# Altium schematic sheet Antenna.SchDoc: Antenna
size A; Author: Micheal Burin; Revision: 1.0; SheetNumber: 3; SheetTotal: 10
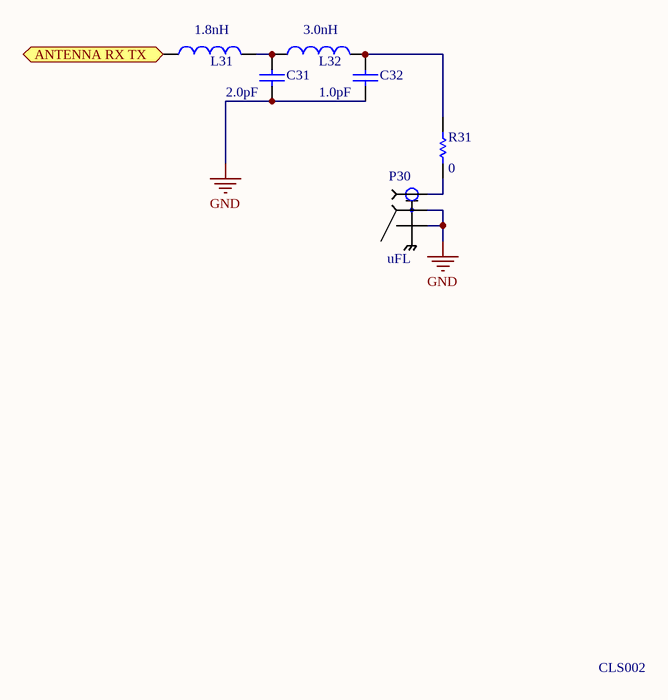
[diagram p0: Antenna.SchDoc]

## Parts
C31  value 2.0pF  [0402_CHIP_FP]  (hidden comment: Capacitor_unpolarized_0805)
C32  value 1.0pF  [0402_CHIP_FP]  (hidden comment: Capacitor_unpolarized_0805)
L31  value 1.8nH  [0402_CHIP_FP]  (hidden comment: Inductor)
L32  value 3.0nH  [0402_CHIP_FP]  (hidden comment: Inductor)
P30  uFL  [MOLEX_1661]
R31  value 0  [0805_CHIP_FP]  (hidden comment: Resistor_0805)

## Ports
ANTENNA RX TX (bidir)

## Nets
GND: C31.1 C32.1 P30.2(GND) P30.3(GND)
ANTENNA RX TX: L31.1 ; port ANTENNA RX TX
NetC31_2: C31.2 L31.2 L32.1
NetC32_2: C32.2 L32.2 R31.2
NetP30_1: P30.1(SIG) R31.1

## Notes on the sheet
- CLS002

## Library data of the parts
C31 = Capacitor_unpolarized_0805: Manufacturer: Murata Electronics North America; Manufacturer Part Number: GJM1555C1H2R0WB01D; Vendor Part Number: 490-11205-1-ND; Vendor: Digikey; Vendor Description: CAP CER 2PF 50V C0G/NP0 0402; ComponentLink1Description: Datasheet; ComponentLink1URL: https://www.digikey.com/product-detail/en/murata-electronics-north-america/GJM1555C1H2R0WB01D/490-11205-1-ND/5333045; Cost: .30
C32 = Capacitor_unpolarized_0805: Manufacturer: Murata Electronics North America; Manufacturer Part Number: GJM1555C1H1R0WB01D; Vendor Part Number: 490-11193-1-ND; Vendor: Digikey; Vendor Description: CAP CER 1PF 50V C0G/NP0 0402; ComponentLink1Description: Datasheet; ComponentLink1URL: https://www.digikey.com/product-detail/en/murata-electronics-north-america/GJM1555C1H1R0WB01D/490-11193-1-ND/5333033; Cost: .30
L31 = Inductor: Manufacturer: Murata Electronics North America; Manufacturer Part Number: LQP15MN1N8B02D; Vendor Part Number: 490-1127-1-ND; Vendor: Digikey; Vendor Description: FIXED IND 1.8NH 280MA 200 MOHM; ComponentLink1Description: Datasheet; ComponentLink1URL: https://www.digikey.com/product-detail/en/murata-electronics-north-america/LQP15MN1N8B02D/490-1127-1-ND/584573; Cost: .19
L32 = Inductor: Manufacturer: Murata Electronics North America; Manufacturer Part Number: LQP15MN3N0B02D; Vendor Part Number: 490-6755-1-ND; Vendor: Digikey; Vendor Description: FIXED IND 3NH 190MA 400 MOHM SMD; ComponentLink1Description: Datasheet; ComponentLink1URL: https://www.digikey.com/product-detail/en/murata-electronics-north-america/LQP15MN3N0B02D/490-6755-1-ND/3845952; Cost: .19
P30 = 1661: uFL SMT Antenna Connector; Manufacturer: Hirose Electric Co Ltd; Manufacturer Part Number: U.FL-R-SMT-1(10); Vendor Part Number: H11891CT-ND; MF: Keystone Electronics; Vendor: Digikey; Vendor Description: CONN U.FL RCPT STR 50 OHM SMD; Package: None; MP: 1661; SnapEDA_Link: https://www.snapeda.com/parts/1661/Keystone%20Electronics/view-part/?ref=snap; Price: None; Availability: Unavailable; Value: *; ComponentLink1Description: Datasheet; ComponentLink1URL: https://www.digikey.com/products/en/connectors-interconnects/coaxial-connectors-rf/437?k=U.FL-R-SMT-1%2810%29&k=&pkeyword=U.FL-R-SMT-1%2810%29&pv7=2&sf=0&FV=ffe001b5&quantity=&ColumnSort=0&page=1&stock=1&datasheet=1&cad=1&rohs=1&pageSize=25; Cost: 1.31
R31 = Resistor_0805: Manufacturer: Vishay Dale; Manufacturer Part Number: CRCW08050000Z0EA; Vendor Part Number: 541-0.0ACT-ND; Vendor: Digikey; Vendor Description: RES SMD 0 OHM JUMPER 1/8W 0805; ComponentLink1Description: Datasheet; ComponentLink1URL: https://www.digikey.com/product-detail/en/vishay-dale/CRCW08050000Z0EA/541-0.0ACT-ND/1180267; Cost: .04